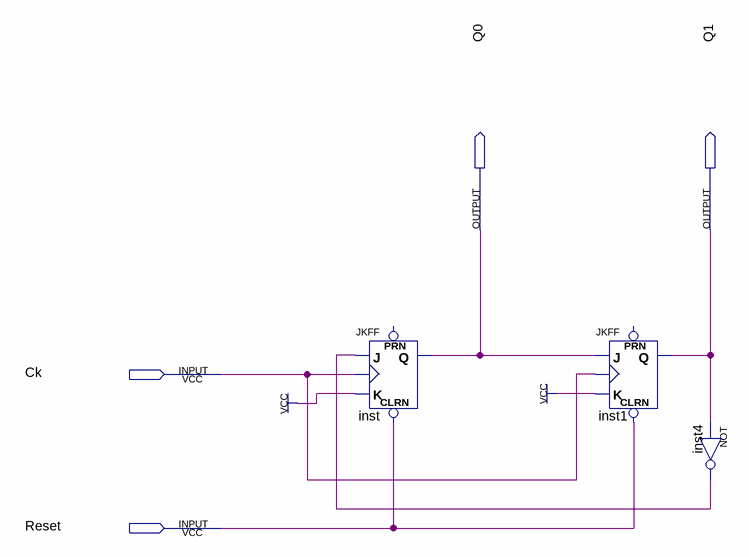
[diagram p0: schematic sheet]
// Quartus schematic Num0_2.bdf as structural Verilog: 3 symbols, 4 pins
module Num0_2 (
  input  Ck,
  input  Reset,
  output Q0,
  output Q1
);

  wire inst4_out;

  JKFF inst (.CLRN(Reset), .K(1'b1), .J(inst4_out), .CLK(Ck), .Q(Q0));  // open: PRN
  JKFF inst1 (.CLRN(Reset), .K(1'b1), .J(Q0), .CLK(Ck), .Q(Q1));  // open: PRN
  not inst4 (inst4_out, Q1);
endmodule
